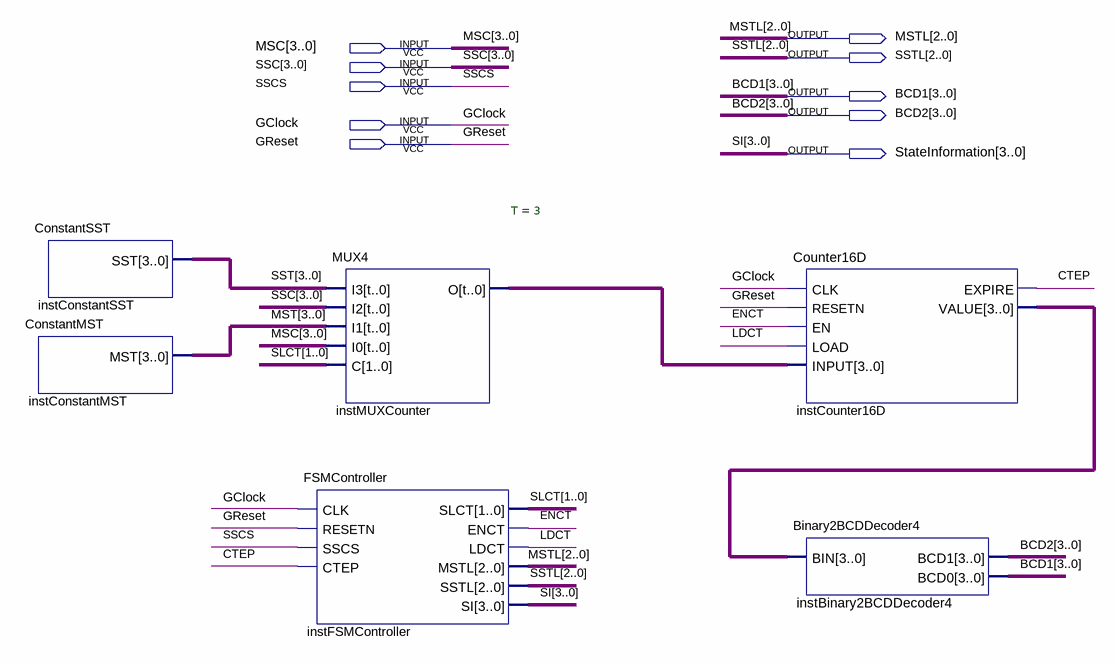
[diagram p0: schematic sheet]
// Quartus schematic TrafficLightController.bdf as structural Verilog: 6 symbols, 10 pins
module TrafficLightController (
  input  [3:0] MSC,
  input  [3:0] SSC,
  input  SSCS,
  input  GClock,
  input  GReset,
  output [2:0] MSTL,
  output [2:0] SSTL,
  output [3:0] BCD1,
  output [3:0] BCD2,
  output [3:0] StateInformation
);

  wire CTEP, ENCT, LDCT;
  wire [1:0] SLCT;
  wire [3:0] instCounter16D_value, instMUXCounter_o, MST, SST;

  ConstantSST instConstantSST (.SST(SST));
  ConstantMST instConstantMST (.MST(MST));
  MUX4 #(.T(3)) instMUXCounter (.I3(SST), .I2(SSC), .I1(MST), .I0(MSC), .C(SLCT), .O(instMUXCounter_o));
  FSMController instFSMController (
    .CLK(GClock), .RESETN(GReset), .SSCS(SSCS), .CTEP(CTEP), .SLCT(SLCT), .ENCT(ENCT), .LDCT(LDCT),
    .MSTL(MSTL), .SSTL(SSTL), .SI(StateInformation));
  Counter16D instCounter16D (
    .CLK(GClock), .RESETN(GReset), .EN(ENCT), .LOAD(LDCT), .INPUT(instMUXCounter_o), .EXPIRE(CTEP),
    .VALUE(instCounter16D_value));
  Binary2BCDDecoder4 instBinary2BCDDecoder4 (.BIN(instCounter16D_value), .BCD1(BCD2), .BCD0(BCD1));

  // Other names for the same wires on the sheet: SI[3:0] = StateInformation
endmodule
